# Altium schematic sheet S3_LED_MAT_FPGA.SCHDOC: FPGA
size A2; Date: "Day, Month  DD, YYYY"; DrawnBy: KSN; Engineer: Dim Su; Revision: 2.0; SheetNumber: 3; SheetTotal: 7; ContentRev1: Original Document; dateREV1: "Aug/08/2018"; dateREV2: "Sep/03/2018"; ContentRev2: C30, SW1 added; Rev1: V1; Rev2: V2; Project: LED_MAT_3
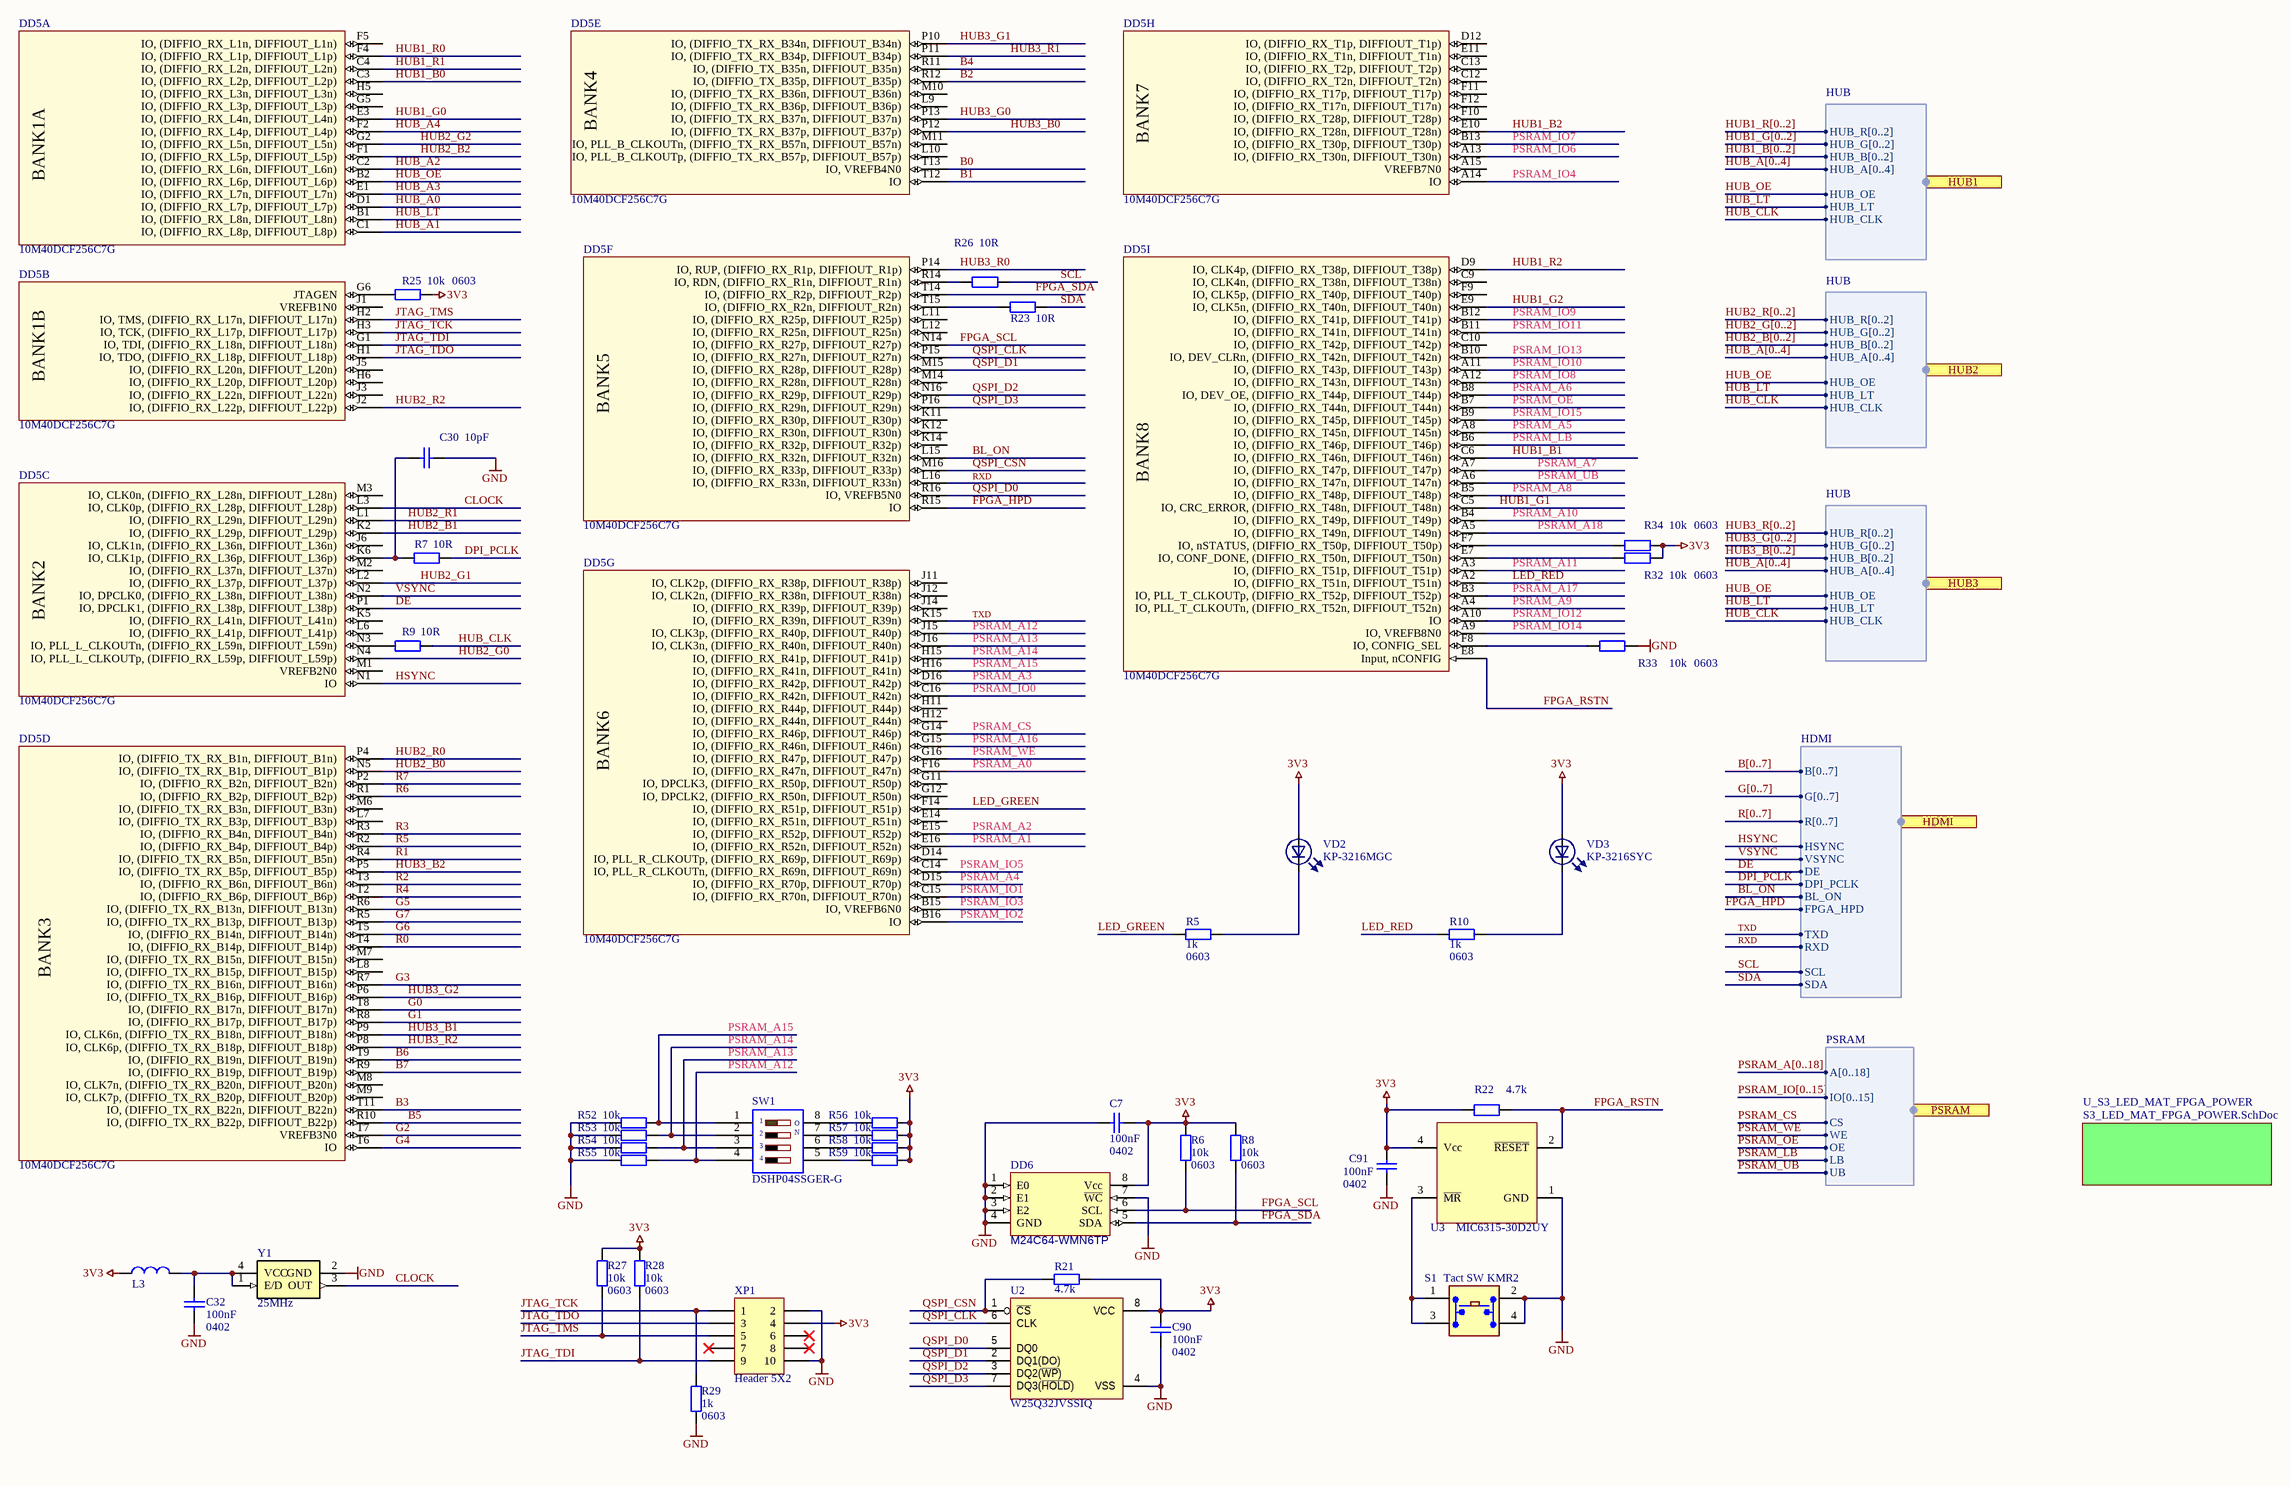
[diagram p0: S3_LED_MAT_FPGA.SCHDOC]

## Parts
C7  value 100nF  Package: 0402  [CAPC1005L]  (hidden comment: 100nF / 0402 / X7R / 16V)
C30  value 10pF  [CAPC1608L]  (hidden comment: 10pF / 0603 / COG / 50V)
C32  value 100nF  Package: 0402  [CAPC1005L]  (hidden comment: 100nF / 0402 / X7R / 16V)
C90  value 100nF  Package: 0402  [CAPC1005L]  (hidden comment: 100nF / 0402 / X7R / 16V)
C91  value 100nF  Package: 0402  [CAPC1005L]  (hidden comment: 100nF / 0402 / X7R / 16V)
DD5  10M40DCF256C7G  [BGA100P16X16-256]  (parts A,B,C,D,E,F,G,H,I of 11)
DD6  M24C64-WMN6TP  [SOIC127P600-8N]
L3  (no value)  [INDC1005L]
R5  value 1k  Package: 0603  [RESC1608L]  (hidden comment: 1k / 1% / 0603 / TC100 / 50V / 0.1W)
R6  value 10k  Package: 0603  [RESC1608L]  (hidden comment: 10k / 1% / 0603 / TC100 / 50V / 0.1W)
R7  value 10R  [RESC1608L]  (hidden comment: 10R / 1% / 0603)
R8  value 10k  Package: 0603  [RESC1608L]  (hidden comment: 10k / 1% / 0603 / TC100 / 50V / 0.1W)
R9  value 10R  [RESC1608L]  (hidden comment: 10R / 1% / 0603)
R10  value 1k  Package: 0603  [RESC1608L]  (hidden comment: 1k / 1% / 0603 / TC100 / 50V / 0.1W)
R21  value 4.7k  [RESC1608L]  (hidden comment: 4.7k / 1% / 0603)
R22  value 4.7k  [RESC1608L]  (hidden comment: 4.7k / 1% / 0603)
R23  value 10R  [RESC1608L]  (hidden comment: 10R / 1% / 0603)
R25  value 10k  Package: 0603  [RESC1608L]  (hidden comment: 10k / 1% / 0603 / TC100 / 50V / 0.1W)
R26  value 10R  [RESC1608L]  (hidden comment: 10R / 1% / 0603)
R27  value 10k  Package: 0603  [RESC1608L]  (hidden comment: 10k / 1% / 0603 / TC100 / 50V / 0.1W)
R28  value 10k  Package: 0603  [RESC1608L]  (hidden comment: 10k / 1% / 0603 / TC100 / 50V / 0.1W)
R29  value 1k  Package: 0603  [RESC1608L]  (hidden comment: 1k / 1% / 0603 / TC100 / 50V / 0.1W)
R32  value 10k  Package: 0603  [RESC1608L]  (hidden comment: 10k / 1% / 0603 / TC100 / 50V / 0.1W)
R33  value 10k  Package: 0603  [RESC1608L]  (hidden comment: 10k / 1% / 0603 / TC100 / 50V / 0.1W)
R34  value 10k  Package: 0603  [RESC1608L]  (hidden comment: 10k / 1% / 0603 / TC100 / 50V / 0.1W)
R52  value 10k  [RESC1608L]  (hidden comment: 10k / 1% / 0603 / TC100 / 50V / 0.1W)
R53  value 10k  [RESC1608L]  (hidden comment: 10k / 1% / 0603 / TC100 / 50V / 0.1W)
R54  value 10k  [RESC1608L]  (hidden comment: 10k / 1% / 0603 / TC100 / 50V / 0.1W)
R55  value 10k  [RESC1608L]  (hidden comment: 10k / 1% / 0603 / TC100 / 50V / 0.1W)
R56  value 10k  [RESC1608L]  (hidden comment: 10k / 1% / 0603 / TC100 / 50V / 0.1W)
R57  value 10k  [RESC1608L]  (hidden comment: 10k / 1% / 0603 / TC100 / 50V / 0.1W)
R58  value 10k  [RESC1608L]  (hidden comment: 10k / 1% / 0603 / TC100 / 50V / 0.1W)
R59  value 10k  [RESC1608L]  (hidden comment: 10k / 1% / 0603 / TC100 / 50V / 0.1W)
S1  Tact SW KMR2  [SW4SMD_63X161LS]
SW1  value DSHP04SSGER-G  [Dipswitch 4 SO8 a]  (hidden comment: DIP SW 4pol, 1.27mm)
U2  W25Q32JVSSIQ  [SOIC127P800X216-8L]
U3  value MIC6315-30D2UY  [SOT-143]  (hidden comment: MIC6315)
VD2  KP-3216MGC  [LED3216X10L]
VD3  KP-3216SYC  [LED3216X10L]
XP1  Header 5X2  [PLD10]
Y1  25MHz  [SMD03025/4CC]

## Sub-sheets
U_S3_LED_MAT_FPGA_POWER = S3_LED_MAT_FPGA_POWER.SchDoc: no entries

## Ports
HDMI (harness HDMI), HUB1 (harness HUB), HUB2 (harness HUB), HUB3 (harness HUB), PSRAM (harness PSRAM)

## Harnesses
HUB: HUB_R[0..2], HUB_G[0..2], HUB_B[0..2], HUB_A[0..4], HUB_OE, HUB_LT, HUB_CLK
HDMI: B[0..7], G[0..7], R[0..7], HSYNC, VSYNC, DE, DPI_PCLK, BL_ON, TXD, RXD, SCL, SDA, FPGA_HPD
PSRAM: A[0..18], IO[0..15], CS, WE, OE, LB, UB

## Nets
3V3: C7.1 C90.2 C91.2 DD6.8(Vcc) L3.1 R6.2 R8.1 R21.2 R22.1 R25.1 R27.1 R28.1 R32.1 R34.1 R56.1 R57.1 R58.1 R59.1 U2.8(VCC) U3.4(Vcc) VD2.1 VD3.1 XP1.4
GND: C7.2 C30.1 C32.1 C90.1 C91.1 DD6.1(E0) DD6.2(E1) DD6.3(E2) DD6.4(GND) DD6.7(~{WC}) R29.2 R33.1 R52.2 R53.2 R54.2 R55.2 S1.2(A2) S1.4 U2.4(VSS) U3.1(GND) XP1.2 XP1.10 Y1.2(GND)
B0: DD5.T13(IO,_VREFB4N0)
B1: DD5.T12(IO)
B2: DD5.R12(IO,_(DIFFIO_TX_B35p,_DIFFIOUT_B35p))
B3: DD5.T11(IO,_(DIFFIO_TX_RX_B22n,_DIFFIOUT_B22n))
B4: DD5.R11(IO,_(DIFFIO_TX_B35n,_DIFFIOUT_B35n))
B5: DD5.R10(IO,_(DIFFIO_TX_RX_B22p,_DIFFIOUT_B22p))
B6: DD5.T9(IO,_(DIFFIO_RX_B19n,_DIFFIOUT_B19n))
B7: DD5.R9(IO,_(DIFFIO_RX_B19p,_DIFFIOUT_B19p))
BL_ON: DD5.L15(IO,_(DIFFIO_RX_R32n,_DIFFIOUT_R32n)) ; port HDMI.BL_ON
CLOCK: DD5.L3(IO,_CLK0p,_(DIFFIO_RX_L28p,_DIFFIOUT_L28p)) Y1.3(OUT)
DE: DD5.P1(IO,_DPCLK1,_(DIFFIO_RX_L38p,_DIFFIOUT_L38p)) ; port HDMI.DE
DPI_PCLK: R7.1 ; port HDMI.DPI_PCLK
FPGA_HPD: DD5.R15(IO) ; port HDMI.FPGA_HPD
FPGA_RSTN: DD5.E8(Input,_nCONFIG) R22.2 U3.2(~{RESET})
FPGA_SCL: DD5.N14(IO,_(DIFFIO_RX_R27p,_DIFFIOUT_R27p)) DD6.6(SCL) R6.1
FPGA_SDA: DD5.T14(IO,_(DIFFIO_RX_R2p,_DIFFIOUT_R2p)) DD6.5(SDA) R8.2
G0: DD5.T8(IO,_(DIFFIO_RX_B17n,_DIFFIOUT_B17n))
G1: DD5.R8(IO,_(DIFFIO_RX_B17p,_DIFFIOUT_B17p))
G2: DD5.T7(VREFB3N0)
G3: DD5.R7(IO,_(DIFFIO_TX_RX_B16n,_DIFFIOUT_B16n))
G4: DD5.T6(IO)
G5: DD5.R6(IO,_(DIFFIO_TX_RX_B13n,_DIFFIOUT_B13n))
G6: DD5.T5(IO,_(DIFFIO_RX_B14n,_DIFFIOUT_B14n))
G7: DD5.R5(IO,_(DIFFIO_TX_RX_B13p,_DIFFIOUT_B13p))
HSYNC: DD5.N1(IO) ; port HDMI.HSYNC
HUB1_B0: DD5.C3(IO,_(DIFFIO_RX_L2p,_DIFFIOUT_L2p))
HUB1_B1: DD5.C6(IO,_(DIFFIO_RX_T46n,_DIFFIOUT_T46n))
HUB1_B2: DD5.E10(IO,_(DIFFIO_RX_T28n,_DIFFIOUT_T28n))
HUB1_G0: DD5.E3(IO,_(DIFFIO_RX_L4n,_DIFFIOUT_L4n))
HUB1_G1: DD5.C5(IO,_CRC_ERROR,_(DIFFIO_RX_T48n,_DIFFIOUT_T48n))
HUB1_G2: DD5.E9(IO,_CLK5n,_(DIFFIO_RX_T40n,_DIFFIOUT_T40n))
HUB1_R0: DD5.F4(IO,_(DIFFIO_RX_L1p,_DIFFIOUT_L1p))
HUB1_R1: DD5.C4(IO,_(DIFFIO_RX_L2n,_DIFFIOUT_L2n))
HUB1_R2: DD5.D9(IO,_CLK4p,_(DIFFIO_RX_T38p,_DIFFIOUT_T38p))
HUB2_B0: DD5.N5(IO,_(DIFFIO_TX_RX_B1p,_DIFFIOUT_B1p))
HUB2_B1: DD5.K2(IO,_(DIFFIO_RX_L29p,_DIFFIOUT_L29p))
HUB2_B2: DD5.F1(IO,_(DIFFIO_RX_L5p,_DIFFIOUT_L5p))
HUB2_G0: DD5.N4(IO,_PLL_L_CLKOUTp,_(DIFFIO_RX_L59p,_DIFFIOUT_L59p))
HUB2_G1: DD5.L2(IO,_(DIFFIO_RX_L37p,_DIFFIOUT_L37p))
HUB2_G2: DD5.G2(IO,_(DIFFIO_RX_L5n,_DIFFIOUT_L5n))
HUB2_R0: DD5.P4(IO,_(DIFFIO_TX_RX_B1n,_DIFFIOUT_B1n))
HUB2_R1: DD5.L1(IO,_(DIFFIO_RX_L29n,_DIFFIOUT_L29n))
HUB2_R2: DD5.J2(IO,_(DIFFIO_RX_L22p,_DIFFIOUT_L22p))
HUB3_B0: DD5.P12(IO,_(DIFFIO_TX_RX_B37p,_DIFFIOUT_B37p))
HUB3_B1: DD5.P9(IO,_CLK6n,_(DIFFIO_TX_RX_B18n,_DIFFIOUT_B18n))
HUB3_B2: DD5.P5(IO,_(DIFFIO_TX_RX_B5p,_DIFFIOUT_B5p))
HUB3_G0: DD5.P13(IO,_(DIFFIO_TX_RX_B37n,_DIFFIOUT_B37n))
HUB3_G1: DD5.P10(IO,_(DIFFIO_TX_RX_B34n,_DIFFIOUT_B34n))
HUB3_G2: DD5.P6(IO,_(DIFFIO_TX_RX_B16p,_DIFFIOUT_B16p))
HUB3_R0: DD5.P14(IO,_RUP,_(DIFFIO_RX_R1p,_DIFFIOUT_R1p))
HUB3_R1: DD5.P11(IO,_(DIFFIO_TX_RX_B34p,_DIFFIOUT_B34p))
HUB3_R2: DD5.P8(IO,_CLK6p,_(DIFFIO_TX_RX_B18p,_DIFFIOUT_B18p))
HUB_A0: DD5.D1(IO,_(DIFFIO_RX_L7p,_DIFFIOUT_L7p))
HUB_A1: DD5.C1(IO,_(DIFFIO_RX_L8p,_DIFFIOUT_L8p))
HUB_A2: DD5.C2(IO,_(DIFFIO_RX_L6n,_DIFFIOUT_L6n))
HUB_A3: DD5.E1(IO,_(DIFFIO_RX_L7n,_DIFFIOUT_L7n))
HUB_A4: DD5.F2(IO,_(DIFFIO_RX_L4p,_DIFFIOUT_L4p))
HUB_CLK: R9.1 ; port HUB2.HUB_CLK, port HUB1.HUB_CLK, port HUB3.HUB_CLK
HUB_LT: DD5.B1(IO,_(DIFFIO_RX_L8n,_DIFFIOUT_L8n)) ; port HUB2.HUB_LT, port HUB1.HUB_LT, port HUB3.HUB_LT
HUB_OE: DD5.B2(IO,_(DIFFIO_RX_L6p,_DIFFIOUT_L6p)) ; port HUB2.HUB_OE, port HUB1.HUB_OE, port HUB3.HUB_OE
JTAG_TCK: DD5.H3(IO,_TCK,_(DIFFIO_RX_L17p,_DIFFIOUT_L17p)) R29.1 XP1.1
JTAG_TDI: DD5.G1(IO,_TDI,_(DIFFIO_RX_L18n,_DIFFIOUT_L18n)) R28.2 XP1.9
JTAG_TDO: DD5.H1(IO,_TDO,_(DIFFIO_RX_L18p,_DIFFIOUT_L18p)) XP1.3
JTAG_TMS: DD5.H2(IO,_TMS,_(DIFFIO_RX_L17n,_DIFFIOUT_L17n)) R27.2 XP1.5
LED_GREEN: DD5.F14(IO,_(DIFFIO_RX_R51p,_DIFFIOUT_R51p)) R5.2
LED_RED: DD5.A2(IO,_(DIFFIO_RX_T51n,_DIFFIOUT_T51n)) R10.2
PSRAM_A0: DD5.F16(IO,_(DIFFIO_RX_R47n,_DIFFIOUT_R47n))
PSRAM_A1: DD5.E16(IO,_(DIFFIO_RX_R52n,_DIFFIOUT_R52n))
PSRAM_A2: DD5.E15(IO,_(DIFFIO_RX_R52p,_DIFFIOUT_R52p))
PSRAM_A3: DD5.D16(IO,_(DIFFIO_RX_R42p,_DIFFIOUT_R42p))
PSRAM_A4: DD5.D15(IO,_(DIFFIO_RX_R70p,_DIFFIOUT_R70p))
PSRAM_A5: DD5.A8(IO,_(DIFFIO_RX_T45n,_DIFFIOUT_T45n))
PSRAM_A6: DD5.B8(IO,_DEV_OE,_(DIFFIO_RX_T44p,_DIFFIOUT_T44p))
PSRAM_A7: DD5.A7(IO,_(DIFFIO_RX_T47p,_DIFFIOUT_T47p))
PSRAM_A8: DD5.B5(IO,_(DIFFIO_RX_T48p,_DIFFIOUT_T48p))
PSRAM_A9: DD5.A4(IO,_PLL_T_CLKOUTn,_(DIFFIO_RX_T52n,_DIFFIOUT_T52n))
PSRAM_A10: DD5.B4(IO,_(DIFFIO_RX_T49p,_DIFFIOUT_T49p))
PSRAM_A11: DD5.A3(IO,_(DIFFIO_RX_T51p,_DIFFIOUT_T51p))
PSRAM_A12: DD5.J15(IO,_CLK3p,_(DIFFIO_RX_R40p,_DIFFIOUT_R40p)) R55.1 SW1.4
PSRAM_A13: DD5.J16(IO,_CLK3n,_(DIFFIO_RX_R40n,_DIFFIOUT_R40n)) R54.1 SW1.3
PSRAM_A14: DD5.H15(IO,_(DIFFIO_RX_R41p,_DIFFIOUT_R41p)) R53.1 SW1.2
PSRAM_A15: DD5.H16(IO,_(DIFFIO_RX_R41n,_DIFFIOUT_R41n)) R52.1 SW1.1
PSRAM_A16: DD5.G15(IO,_(DIFFIO_RX_R46n,_DIFFIOUT_R46n))
PSRAM_A17: DD5.B3(IO,_PLL_T_CLKOUTp,_(DIFFIO_RX_T52p,_DIFFIOUT_T52p))
PSRAM_A18: DD5.A5(IO,_(DIFFIO_RX_T49n,_DIFFIOUT_T49n))
PSRAM_CS: DD5.G14(IO,_(DIFFIO_RX_R46p,_DIFFIOUT_R46p)) ; port PSRAM.CS
PSRAM_IO0: DD5.C16(IO,_(DIFFIO_RX_R42n,_DIFFIOUT_R42n))
PSRAM_IO1: DD5.C15(IO,_(DIFFIO_RX_R70n,_DIFFIOUT_R70n))
PSRAM_IO2: DD5.B16(IO)
PSRAM_IO3: DD5.B15(IO,_VREFB6N0)
PSRAM_IO4: DD5.A14(IO)
PSRAM_IO5: DD5.C14(IO,_PLL_R_CLKOUTn,_(DIFFIO_RX_R69n,_DIFFIOUT_R69n))
PSRAM_IO6: DD5.A13(IO,_(DIFFIO_RX_T30n,_DIFFIOUT_T30n))
PSRAM_IO7: DD5.B13(IO,_(DIFFIO_RX_T30p,_DIFFIOUT_T30p))
PSRAM_IO8: DD5.A12(IO,_(DIFFIO_RX_T43n,_DIFFIOUT_T43n))
PSRAM_IO9: DD5.B12(IO,_(DIFFIO_RX_T41p,_DIFFIOUT_T41p))
PSRAM_IO10: DD5.A11(IO,_(DIFFIO_RX_T43p,_DIFFIOUT_T43p))
PSRAM_IO11: DD5.B11(IO,_(DIFFIO_RX_T41n,_DIFFIOUT_T41n))
PSRAM_IO12: DD5.A10(IO)
PSRAM_IO13: DD5.B10(IO,_DEV_CLRn,_(DIFFIO_RX_T42n,_DIFFIOUT_T42n))
PSRAM_IO14: DD5.A9(IO,_VREFB8N0)
PSRAM_IO15: DD5.B9(IO,_(DIFFIO_RX_T45p,_DIFFIOUT_T45p))
PSRAM_LB: DD5.B6(IO,_(DIFFIO_RX_T46p,_DIFFIOUT_T46p)) ; port PSRAM.LB
PSRAM_OE: DD5.B7(IO,_(DIFFIO_RX_T44n,_DIFFIOUT_T44n)) ; port PSRAM.OE
PSRAM_UB: DD5.A6(IO,_(DIFFIO_RX_T47n,_DIFFIOUT_T47n)) ; port PSRAM.UB
PSRAM_WE: DD5.G16(IO,_(DIFFIO_RX_R47p,_DIFFIOUT_R47p)) ; port PSRAM.WE
QSPI_CLK: DD5.P15(IO,_(DIFFIO_RX_R27n,_DIFFIOUT_R27n)) U2.6(CLK)
QSPI_CSN: DD5.M16(IO,_(DIFFIO_RX_R33p,_DIFFIOUT_R33p)) R21.1 U2.1(~{CS})
QSPI_D0: DD5.R16(IO,_VREFB5N0) U2.5(DQ0)
QSPI_D1: DD5.M15(IO,_(DIFFIO_RX_R28p,_DIFFIOUT_R28p)) U2.2(DQ1(DO))
QSPI_D2: DD5.N16(IO,_(DIFFIO_RX_R29p,_DIFFIOUT_R29p)) U2.3(DQ2(~{WP}))
QSPI_D3: DD5.P16(IO,_(DIFFIO_RX_R29n,_DIFFIOUT_R29n)) U2.7(DQ3(~{HOLD}))
R0: DD5.T4(IO,_(DIFFIO_RX_B14p,_DIFFIOUT_B14p))
R1: DD5.R4(IO,_(DIFFIO_TX_RX_B5n,_DIFFIOUT_B5n))
R2: DD5.T3(IO,_(DIFFIO_RX_B6n,_DIFFIOUT_B6n))
R3: DD5.R3(IO,_(DIFFIO_RX_B4n,_DIFFIOUT_B4n))
R4: DD5.T2(IO,_(DIFFIO_RX_B6p,_DIFFIOUT_B6p))
R5: DD5.R2(IO,_(DIFFIO_RX_B4p,_DIFFIOUT_B4p))
R6: DD5.R1(IO,_(DIFFIO_RX_B2p,_DIFFIOUT_B2p))
R7: DD5.P2(IO,_(DIFFIO_RX_B2n,_DIFFIOUT_B2n))
RXD: DD5.L16(IO,_(DIFFIO_RX_R33n,_DIFFIOUT_R33n)) ; port HDMI.RXD
SCL: R26.1 ; port HDMI.SCL
SDA: R23.1 ; port HDMI.SDA
TXD: DD5.K15(IO,_(DIFFIO_RX_R39n,_DIFFIOUT_R39n)) ; port HDMI.TXD
VSYNC: DD5.N2(IO,_DPCLK0,_(DIFFIO_RX_L38n,_DIFFIOUT_L38n)) ; port HDMI.VSYNC
NetC30_2: C30.2 DD5.K6(IO,_CLK1p,_(DIFFIO_RX_L36p,_DIFFIOUT_L36p)) R7.2
NetC32_2: C32.2 L3.2 Y1.1(E/D) Y1.4(VCC)
NetDD5_E7: DD5.E7(IO,_CONF_DONE,_(DIFFIO_RX_T50n,_DIFFIOUT_T50n)) R32.2
NetDD5_F7: DD5.F7(IO,_nSTATUS,_(DIFFIO_RX_T50p,_DIFFIOUT_T50p)) R34.2
NetDD5_F8: DD5.F8(IO,_CONFIG_SEL) R33.2
NetDD5_G6: DD5.G6(JTAGEN) R25.2
NetDD5_N3: DD5.N3(IO,_PLL_L_CLKOUTn,_(DIFFIO_RX_L59n,_DIFFIOUT_L59n)) R9.2
NetDD5_R14: DD5.R14(IO,_RDN,_(DIFFIO_RX_R1n,_DIFFIOUT_R1n)) R26.2
NetDD5_T15: DD5.T15(IO,_(DIFFIO_RX_R2n,_DIFFIOUT_R2n)) R23.2
NetR5_1: R5.1 VD2.2
NetR10_1: R10.1 VD3.2
NetR56_2: R56.2 SW1.8
NetR57_2: R57.2 SW1.7
NetR58_2: R58.2 SW1.6
NetR59_2: R59.2 SW1.5
NetS1_1: S1.1(A1) S1.3(A3) U3.3(~{MR})

Not connected (* = marked no-connect by the designer): DD5 A15(VREFB7N0) C9(IO,_CLK4n,_(DIFFIO_RX_T38n,_DIFFIOUT_T38n)) C10(IO,_(DIFFIO_RX_T42p,_DIFFIOUT_T42p)) C12(IO,_(DIFFIO_RX_T2n,_DIFFIOUT_T2n)) C13(IO,_(DIFFIO_RX_T2p,_DIFFIOUT_T2p)) D12(IO,_(DIFFIO_RX_T1p,_DIFFIOUT_T1p)) D14(IO,_PLL_R_CLKOUTp,_(DIFFIO_RX_R69p,_DIFFIOUT_R69p)) E11(IO,_(DIFFIO_RX_T1n,_DIFFIOUT_T1n)) E14(IO,_(DIFFIO_RX_R51n,_DIFFIOUT_R51n)) F5(IO,_(DIFFIO_RX_L1n,_DIFFIOUT_L1n)) F9(IO,_CLK5p,_(DIFFIO_RX_T40p,_DIFFIOUT_T40p)) F10(IO,_(DIFFIO_RX_T28p,_DIFFIOUT_T28p)) F11(IO,_(DIFFIO_RX_T17p,_DIFFIOUT_T17p)) F12(IO,_(DIFFIO_RX_T17n,_DIFFIOUT_T17n)) G5(IO,_(DIFFIO_RX_L3p,_DIFFIOUT_L3p)) G11(IO,_DPCLK3,_(DIFFIO_RX_R50p,_DIFFIOUT_R50p)) G12(IO,_DPCLK2,_(DIFFIO_RX_R50n,_DIFFIOUT_R50n)) H5(IO,_(DIFFIO_RX_L3n,_DIFFIOUT_L3n)) H6(IO,_(DIFFIO_RX_L20p,_DIFFIOUT_L20p)) H11(IO,_(DIFFIO_RX_R44p,_DIFFIOUT_R44p)) H12(IO,_(DIFFIO_RX_R44n,_DIFFIOUT_R44n)) J1(VREFB1N0) J3(IO,_(DIFFIO_RX_L22n,_DIFFIOUT_L22n)) J5(IO,_(DIFFIO_RX_L20n,_DIFFIOUT_L20n)) J6(IO,_CLK1n,_(DIFFIO_RX_L36n,_DIFFIOUT_L36n)) J11(IO,_CLK2p,_(DIFFIO_RX_R38p,_DIFFIOUT_R38p)) J12(IO,_CLK2n,_(DIFFIO_RX_R38n,_DIFFIOUT_R38n)) J14(IO,_(DIFFIO_RX_R39p,_DIFFIOUT_R39p)) K5(IO,_(DIFFIO_RX_L41n,_DIFFIOUT_L41n)) K11(IO,_(DIFFIO_RX_R30p,_DIFFIOUT_R30p)) K12(IO,_(DIFFIO_RX_R30n,_DIFFIOUT_R30n)) K14(IO,_(DIFFIO_RX_R32p,_DIFFIOUT_R32p)) L6(IO,_(DIFFIO_RX_L41p,_DIFFIOUT_L41p)) L7(IO,_(DIFFIO_TX_RX_B3p,_DIFFIOUT_B3p)) L8(IO,_(DIFFIO_TX_RX_B15p,_DIFFIOUT_B15p)) L9(IO,_(DIFFIO_TX_RX_B36p,_DIFFIOUT_B36p)) L10(IO,_PLL_B_CLKOUTp,_(DIFFIO_TX_RX_B57p,_DIFFIOUT_B57p)) L11(IO,_(DIFFIO_RX_R25p,_DIFFIOUT_R25p)) L12(IO,_(DIFFIO_RX_R25n,_DIFFIOUT_R25n)) M1(VREFB2N0) M2(IO,_(DIFFIO_RX_L37n,_DIFFIOUT_L37n)) M3(IO,_CLK0n,_(DIFFIO_RX_L28n,_DIFFIOUT_L28n)) M6(IO,_(DIFFIO_TX_RX_B3n,_DIFFIOUT_B3n)) M7(IO,_(DIFFIO_TX_RX_B15n,_DIFFIOUT_B15n)) M8(IO,_CLK7n,_(DIFFIO_TX_RX_B20n,_DIFFIOUT_B20n)) M9(IO,_CLK7p,_(DIFFIO_TX_RX_B20p,_DIFFIOUT_B20p)) M10(IO,_(DIFFIO_TX_RX_B36n,_DIFFIOUT_B36n)) M11(IO,_PLL_B_CLKOUTn,_(DIFFIO_TX_RX_B57n,_DIFFIOUT_B57n)) M14(IO,_(DIFFIO_RX_R28n,_DIFFIOUT_R28n)); XP1 6* 7* 8*

## Buses and harness runs
bus B[0..7]
bus G[0..7]
bus HUB1_B[0..2]
bus HUB1_G[0..2]
bus HUB1_R[0..2]
bus HUB2_B[0..2]
bus HUB2_G[0..2]
bus HUB2_R[0..2]
bus HUB3_B[0..2]
bus HUB3_G[0..2]
bus HUB3_R[0..2]
bus HUB_A[0..4]
bus PSRAM_A[0..18]
bus PSRAM_IO[0..15]
bus R[0..7]

## Notes on the sheet
- Title
- Size:
- Date:
- File:
- A2
- Number:
- Time:
- Revision:
- Sheet
- of
- (in symbol 10M40DCF256C7G, part A) BANK1A
- (in symbol 10M40DCF256C7G, part B) BANK1B
- (in symbol 10M40DCF256C7G, part C) BANK2
- (in symbol 10M40DCF256C7G, part D) BANK3
- (in symbol 10M40DCF256C7G, part E) BANK4
- (in symbol 10M40DCF256C7G, part F) BANK5
- (in symbol 10M40DCF256C7G, part G) BANK6
- (in symbol 10M40DCF256C7G, part H) BANK7
- (in symbol 10M40DCF256C7G, part I) BANK8
- (in symbol DIP SW 4pol, 1.27mm) O; N

## Library data of the parts
C7 C32 C90 C91 = 100nF / 0402 / X7R / 16V: Capacitor ceramic; Manufacturer: SAMSUNG; Manufacturer Part Number: CL05B104KO5NNNC; Voltage: 16V; CompName: Capacitor; Price: 0.2
C30 = 10pF / 0603 / COG / 50V: Capacitor ceramic; Manufacturer: SAMSUNG; Manufacturer Part Number: CL10C100JB8NNNC; Tolerance: 5%; Package: 0603; Voltage: 50V; CompName: Capacitor; Category: Capacitor; Price: 0.2; Type: COG
DD5 = 10M40DCF256C7G: FPGA; CompName: IC; Manufacturer: ALTERA; Manufacturer Part Number: 10M40DCF256C7GA; CompKind: 0; CompType: 10M40DCF256C7G; ValueBOM: 10M40DCF256C7G; Package: BGA256; Price: 1800; Remarks: *; Supplier: ARROW
DD6 = M24C64-WDW6TP: Manufacturer: ST; CompName: IC; Remarks: ./.; Voltage: 3.0...5.5V; Category: I2C EEPROM; Package: SO8; Tolerance: ./.; Type: M24C64-WMN6TP; Manufacturer Part Number: M24C64-WMN6TP; Price: 7.02; Temperature: -40...+85°C; Value: M24C64-WMN6TP
L3 = L0402_BLM15: General 0402 - type Chip Inductor; Manufacturer: Murata; Manufacturer Part Number: BLM15AG601SN1; CompName: Inductor; Package: 0402; Price: 0.05
R5 R10 R29 = 1k / 1% / 0603 / TC100 / 50V / 0.1W: Resistor; Remarks: replaceable; Tolerance: 1%; Voltage: 50V; CompName: Resistor; Price: 0.02
R6 R8 R25 R27 R28 R32-R34 R52-R59 = 10k / 1% / 0603 / TC100 / 50V / 0.1W: Resistor; Tolerance: 1%; Voltage: 50V; CompName: Resistor; Price: 0.02
  R52-R59: Package: 0603
R7 R9 R23 R26 = 10R / 1% / 0603: Manufacturer: YAGEO; Manufacturer Part Number: RC0603FR-0710RL; CompName: Resistor; Remarks: replaceable; Tolerance: 1%; Category: Resistor; Price: 0.02; Supplier: ./.; Supplier Order Code: ./.; Temperature: -40...+85°C; Package: 0603
R21 R22 = 4.7k / 1% / 0603: Manufacturer: YAGEO; Manufacturer Part Number: RC0603FR-074K7L; CompName: Resistor; Remarks: replaceable; Tolerance: 1%; Category: Resistor; Price: 0.02; Supplier: ./.; Supplier Order Code: ./.; Temperature: -40...+85°C; Package: 0603
S1 = Tact SW KMR2: Microminiature Tact Switch for SMT; Manufacturer: C&K Components; Manufacturer Part Number: KMR211GLFS; Remarks: ./.; Value: KMR211GLFS; Category: Switch; Supplier: Digikey; Supplier Order Code: 401-1426-2-ND; Package: KMR211GLFS; Price: 4.71; Temperature: - 40 C + 125 C; Tolerance: ./.; Type: KMR211GLFS; Voltage: ./.
SW1 = DIP SW 4pol, 1.27mm: Manufacturer: SWITRONIC; Tolerance: 1%; Remarks: replaceable; Manufacturer Part Number: DSHP04SSGER-G; Category: Switch; Price: 13.08; Temperature: -40...+85°C; Package: SO-8
U2 = W25Q32JVSSIQ: 32Mbit Quad Serial Flash in SOIC W package; Manufacturer: WINBOND; CompName: IC; Tolerance: ./.; Voltage: 2.7...3.6V; Category: IC; Manufacturer Part Number: W25Q32JVSSIQ; Package: SO-8 WIDE; Price: 30; Remarks: W25Q32JVSSIQ; Supplier: ARROW; Supplier Order Code: W25Q32JVSSIQ; Temperature: -40...+85°C; Type: SO; Value: W25Q32JVSSIQ
U3 = MIC6315: 3V VOLTAGE SUPERVISOR; Manufacturer: MICROCHIP; CompName: IC; Remarks: Power Monitor IC; Voltage: 3.3V; Manufacturer Part Number: MIC6315-30D2UY; Package: SOT-143; Category: IC; Price: 12; Supplier: Mouser; Supplier Order Code: 998-MIC6315-30D2UYTR; Temperature: -40°C - 85°C
VD2 = KP-3216MGC: SMD LED GREEN; Manufacturer: KINGBRIGHT; CompName: LED; Manufacturer Part Number: KP-3216MGC; Package: 3216; Price: 3.5; Type: Green
VD3 = KP-3216SYC: SMD LED YELLOW; Manufacturer: KINGBRIGHT; CompName: LED; Manufacturer Part Number: KP-3216SYC; Package: 3216; Price: 4.34; Type: Yellow
XP1 = Header 5X2: Header, 5-Pin, Dual row; CompName: Connector; Manufacturer: FCI; Voltage: 50V; Price: .1; Type: Connector
Y1 = OSC / 3225 / 25M: SMD Oscillator with Stop Function; Manufacturer: YOKETANT; Manufacturer Part Number: SO3225-025000-FIE-BBA-A1; Tolerance: 25ppm; CompName: Oscillator; Value: 25MHz; Package: 3225; Price: 10